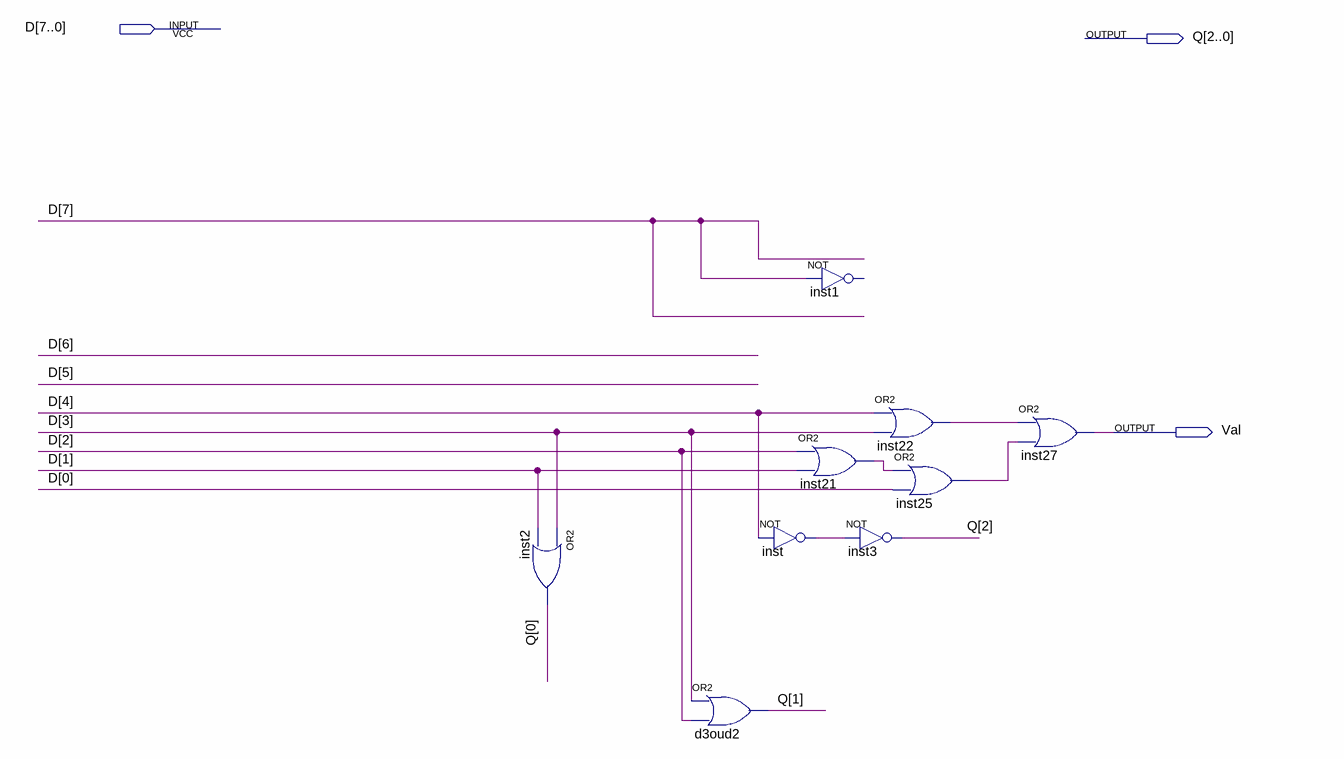
[diagram p0: schematic sheet]
// Quartus schematic encoderNEANDER.bdf as structural Verilog: 9 symbols, 3 pins
module encoderNEANDER (
  input  [7:0] D,
  output [2:0] Q,
  output Val
);

  wire inst21_out, inst22_out, inst25_out, inst_out;

  or inst2 (Q[0], D[3], D[1]);
  not inst (inst_out, D[4]);
  or d3oud2 (Q[1], D[3], D[2]);
  // NOT inst1 has open pins: IN=D[7], OUT=open
  or inst21 (inst21_out, D[2], D[1]);
  or inst22 (inst22_out, D[4], D[3]);
  or inst25 (inst25_out, inst21_out, D[0]);
  not inst3 (Q[2], inst_out);
  or inst27 (Val, inst22_out, inst25_out);
endmodule
